# Altium schematic sheet Ampli_FI2.SchDoc
size A4
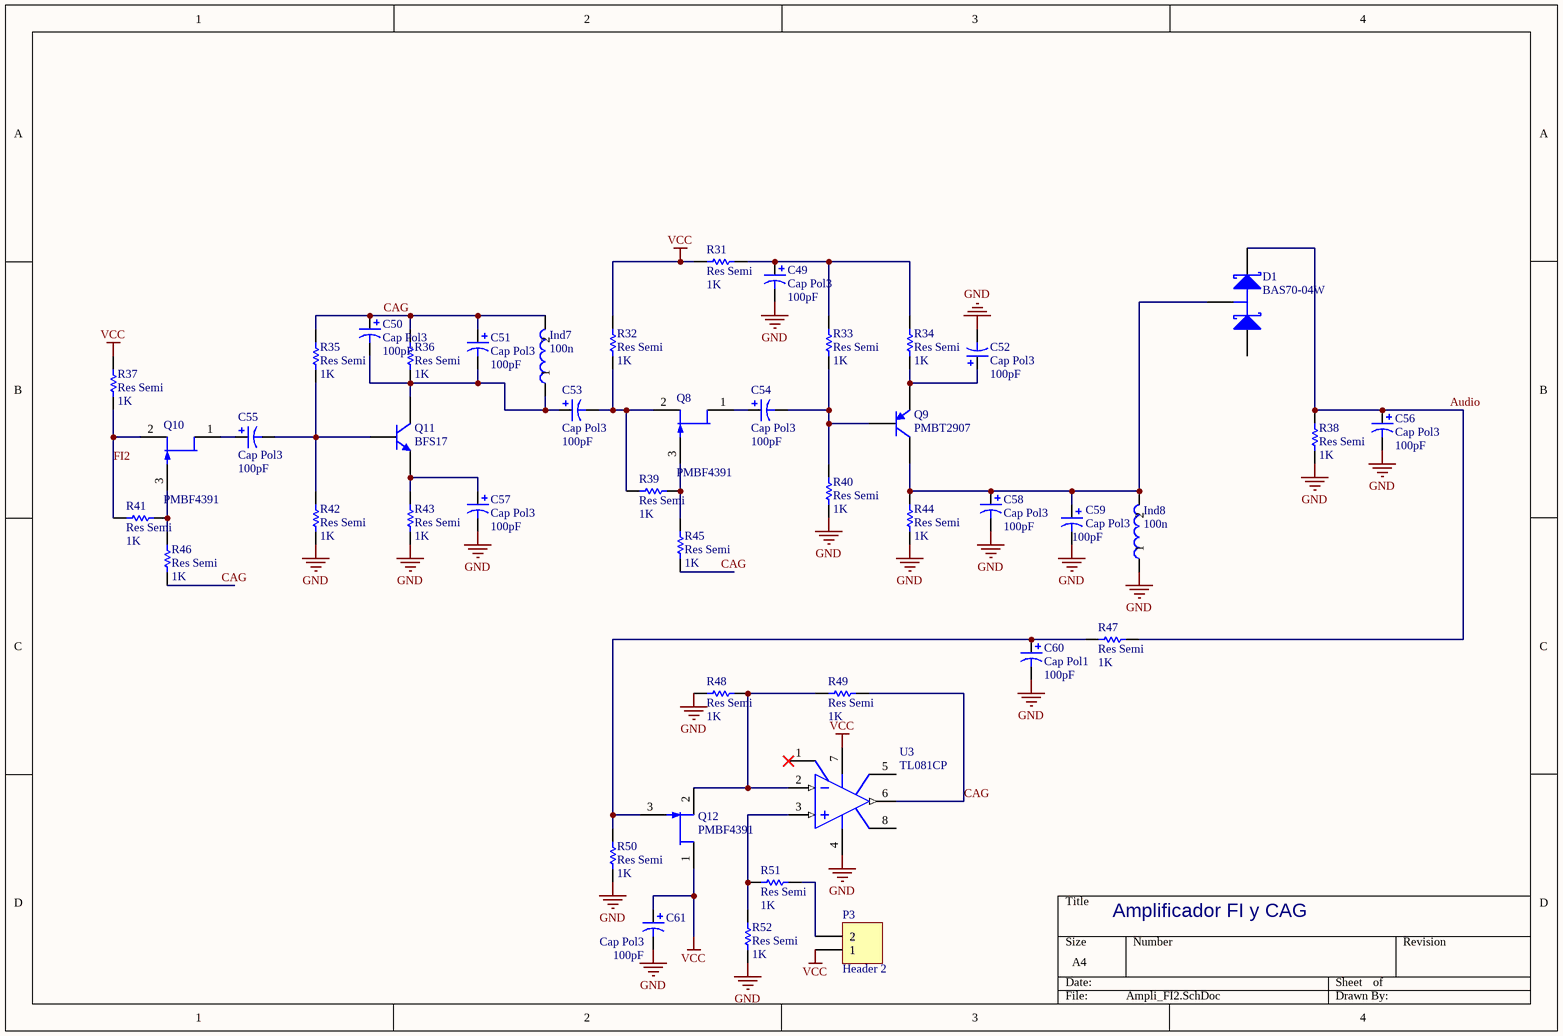
[diagram p0: Ampli_FI2.SchDoc]

## Parts
C49  Cap Pol3  value 100pF  [C0805]
C50  Cap Pol3  value 100pF  [C0805]
C51  Cap Pol3  value 100pF  [C0805]
C52  Cap Pol3  value 100pF  [C0805]
C53  Cap Pol3  value 100pF  [C0805]
C54  Cap Pol3  value 100pF  [C0805]
C55  Cap Pol3  value 100pF  [C0805]
C56  Cap Pol3  value 100pF  [C0805]
C57  Cap Pol3  value 100pF  [C0805]
C58  Cap Pol3  value 100pF  [C0805]
C59  Cap Pol3  value 100pF  [C0805]
C60  Cap Pol1  value 100pF  [B]
C61  Cap Pol3  value 100pF  [C0805]
D1  BAS70-04W  [SOT323_N]
Ind7  Valor: 100n  [AXIAL-0.3]  (hidden comment: Ind2)
Ind8  Valor: 100n  [AXIAL-0.3]  (hidden comment: Ind2)
P3  Header 2  [HDR1X2]
Q8  PMBF4391  [SOT-23]
Q9  PMBT2907  [SOT-23]
Q10  PMBF4391  [SOT-23]
Q11  BFS17  [SOT-23]
Q12  PMBF4391  [SOT-23]
R31  Res Semi  value 1K  [2012[0805]]
R32  Res Semi  value 1K  [2012[0805]]
R33  Res Semi  value 1K  [2012[0805]]
R34  Res Semi  value 1K  [2012[0805]]
R35  Res Semi  value 1K  [2012[0805]]
R36  Res Semi  value 1K  [2012[0805]]
R37  Res Semi  value 1K  [2012[0805]]
R38  Res Semi  value 1K  [2012[0805]]
R39  Res Semi  value 1K  [2012[0805]]
R40  Res Semi  value 1K  [2012[0805]]
R41  Res Semi  value 1K  [2012[0805]]
R42  Res Semi  value 1K  [2012[0805]]
R43  Res Semi  value 1K  [2012[0805]]
R44  Res Semi  value 1K  [2012[0805]]
R45  Res Semi  value 1K  [2012[0805]]
R46  Res Semi  value 1K  [2012[0805]]
R47  Res Semi  value 1K  [2012[0805]]
R48  Res Semi  value 1K  [2012[0805]]
R49  Res Semi  value 1K  [2012[0805]]
R50  Res Semi  value 1K  [2012[0805]]
R51  Res Semi  value 1K  [2012[0805]]
R52  Res Semi  value 1K  [2012[0805]]
U3  TL081CP  [DIP8]

## Nets
GND: C49.2 C52.2 C56.2 C57.2 C58.2 C59.2 C60.2 C61.2 Ind8.1 R38.1 R40.2 R42.1 R43.1 R44.2 R48.1 R50.2 R52.2 U3.4(V-)
VCC: C61.1 P3.1 Q12.1(D) R31.2 R32.2 R37.1 U3.7(V+)
Audio: C56.1 D1.2(K) R38.2 R47.1
CAG: C50.1 C51.1 Ind7.2 R35.2 R36.2 R45.2 R46.2 R49.2 U3.6(OUT)
FI2: Q10.2(S) R37.2 R41.1
NetC49_1: C49.1 R31.1 R33.1 R34.1
NetC50_2: C50.2 C51.2 C53.1 Ind7.1 Q11.3(C) R36.1
NetC52_1: C52.1 Q9.2(E) R34.2
NetC53_2: C53.2 Q8.2(S) R32.1 R39.1
NetC54_1: C54.1 Q8.1(D)
NetC54_2: C54.2 Q9.1(B) R33.2 R40.1
NetC55_1: C55.1 Q10.1(D)
NetC55_2: C55.2 Q11.1(B) R35.1 R42.2
NetC57_1: C57.1 Q11.2(E) R43.2
NetC58_1: C58.1 C59.1 D1.3(C) Ind8.2 Q9.3(C) R44.1
NetC60_1: C60.1 Q12.3(G) R47.2 R50.1
NetP3_2: P3.2 R51.1
NetQ8_3: Q8.3(G) R39.2 R45.1
NetQ10_3: Q10.3(G) R41.2 R46.1
NetQ12_2: Q12.2(S) R48.2 R49.1 U3.2(IN-)
NetR51_2: R51.2 R52.1 U3.3(IN+)

Not connected (* = marked no-connect by the designer): D1 1(A); U3 1(OS_NULL)* 5(OS_NULL) 8(NC)

## Notes on the sheet
- Amplificador FI y CAG

## Library data of the parts
C49-C59 C61 = Cap Pol3: Polarized Capacitor (Surface Mount); Published: 8-Jun-2000; LatestRevisionDate: 17-Jul-2002; LatestRevisionNote: Re-released for DXP Platform.; PackageReference: C0805; Publisher: Altium Limited
C60 = Cap Pol1: Polarized Capacitor (Radial); Published: 8-Jun-2000; LatestRevisionDate: 17-Jul-2002; LatestRevisionNote: Re-released for DXP Platform.; PackageReference: RB7.6-15; Publisher: Altium Limited
D1 = BAS70-04W: Schottky Barrier Double Diode; Published: 17-Sep-2003; LatestRevisionDate: 12-Dec-2006; LatestRevisionNote: IPC-7351 Footprint Added.; DatasheetVersion: 26-Mar-1999; PackageVersion: Apr-1999; PackageReference: SOT323; Publisher: Altium Limited; PackageDescription: 3-Pin SOT-323 Package 0.65 mm Pitch, 2.1 mm Lead Span; ComponentLink1Description: Manufacturer Link; ComponentLink1URL: http://www.semiconductors.philips.com/; ComponentLink2Description: Datasheet; ComponentLink2URL: http://www.semiconductors.philips.com/acrobat/datasheets/BAS70W_3.pdf
P3 = Header 2: Header, 2-Pin; LatestRevisionDate: 17-Jul-2002; LatestRevisionNote: Re-released for DXP Platform.; Publisher: Altium Limited
Q8 Q10 Q12 = PMBF4391: N-channel Silicon Junction Field-effect Transistor; Published: 17-Sep-2003; LatestRevisionDate: 12-Dec-2006; LatestRevisionNote: IPC-7351 Footprint Added.; DatasheetVersion: Apr-1995; PackageVersion: May-1999; PackageReference: SOT23; Publisher: Altium Limited; PackageDescription: 3-Pin SOT-23 Package 0.95 mm Pitch, 2.3 mm Lead Span; ComponentLink1Description: Manufacturer Link; ComponentLink1URL: http://www.semiconductors.philips.com/; ComponentLink2Description: Datasheet; ComponentLink2URL: http://www.semiconductors.philips.com/acrobat/datasheets/PMBF4391_4392_4393_CNV_2.pdf
Q9 = PMBT2907: PNP Switching Transistor; Published: 17-Sep-2003; LatestRevisionDate: 12-Dec-2006; LatestRevisionNote: IPC-7351 Footprint Added.; DatasheetVersion: 27-Apr-1999; PackageVersion: May-1999; PackageReference: SOT23; Publisher: Altium Limited; PackageDescription: 3-Pin SOT-23 Package 0.95 mm Pitch, 2.3 mm Lead Span; ComponentLink1Description: Manufacturer Link; ComponentLink1URL: http://www.semiconductors.philips.com/; ComponentLink2Description: Datasheet; ComponentLink2URL: http://www.semiconductors.philips.com/acrobat/datasheets/PMBT2907_PMBT2907A_5.pdf
Q11 = BFS17: NPN 1 GHz Wideband Transistor; Published: 17-Sep-2003; LatestRevisionDate: 12-Dec-2006; LatestRevisionNote: IPC-7351 Footprint Added.; DatasheetVersion: Sep-1995; PackageVersion: May-1999; PackageReference: SOT23; Publisher: Altium Limited; PackageDescription: 3-Pin SOT-23 Package 0.95 mm Pitch, 2.3 mm Lead Span; ComponentLink1Description: Manufacturer Link; ComponentLink1URL: http://www.semiconductors.philips.com/; ComponentLink2Description: Datasheet; ComponentLink2URL: http://www.semiconductors.philips.com/acrobat/datasheets/BFS17_2.pdf
R31-R52 = Res Semi: Semiconductor Resistor; Published: 8-Jun-2000; LatestRevisionDate: 17-Jul-2002; LatestRevisionNote: Re-released for DXP Platform.; PackageReference: AXIAL-0.5; Publisher: Altium Limited
U3 = TL081CP: JFET-Input Operational Amplifier; Published: 17-Jul-2002; LatestRevisionDate: 06-Jun-2005; LatestRevisionNote: Stylized 3D Model Added.; DatasheetVersion: 1988; PackageReference: 626-05; Publisher: Altium Limited; PackageDescription: DIP; 8 Leads; Row Spacing 7.62 mm; Pitch 2.54 mm; ComponentLink1Description: Manufacturer Link; ComponentLink1URL: http://www.onsemi.com/site/products/parametrics/0,4446,251,00.html